# Altium schematic sheet uC.SchDoc
size A3; SheetNumber: 2; SheetTotal: 7
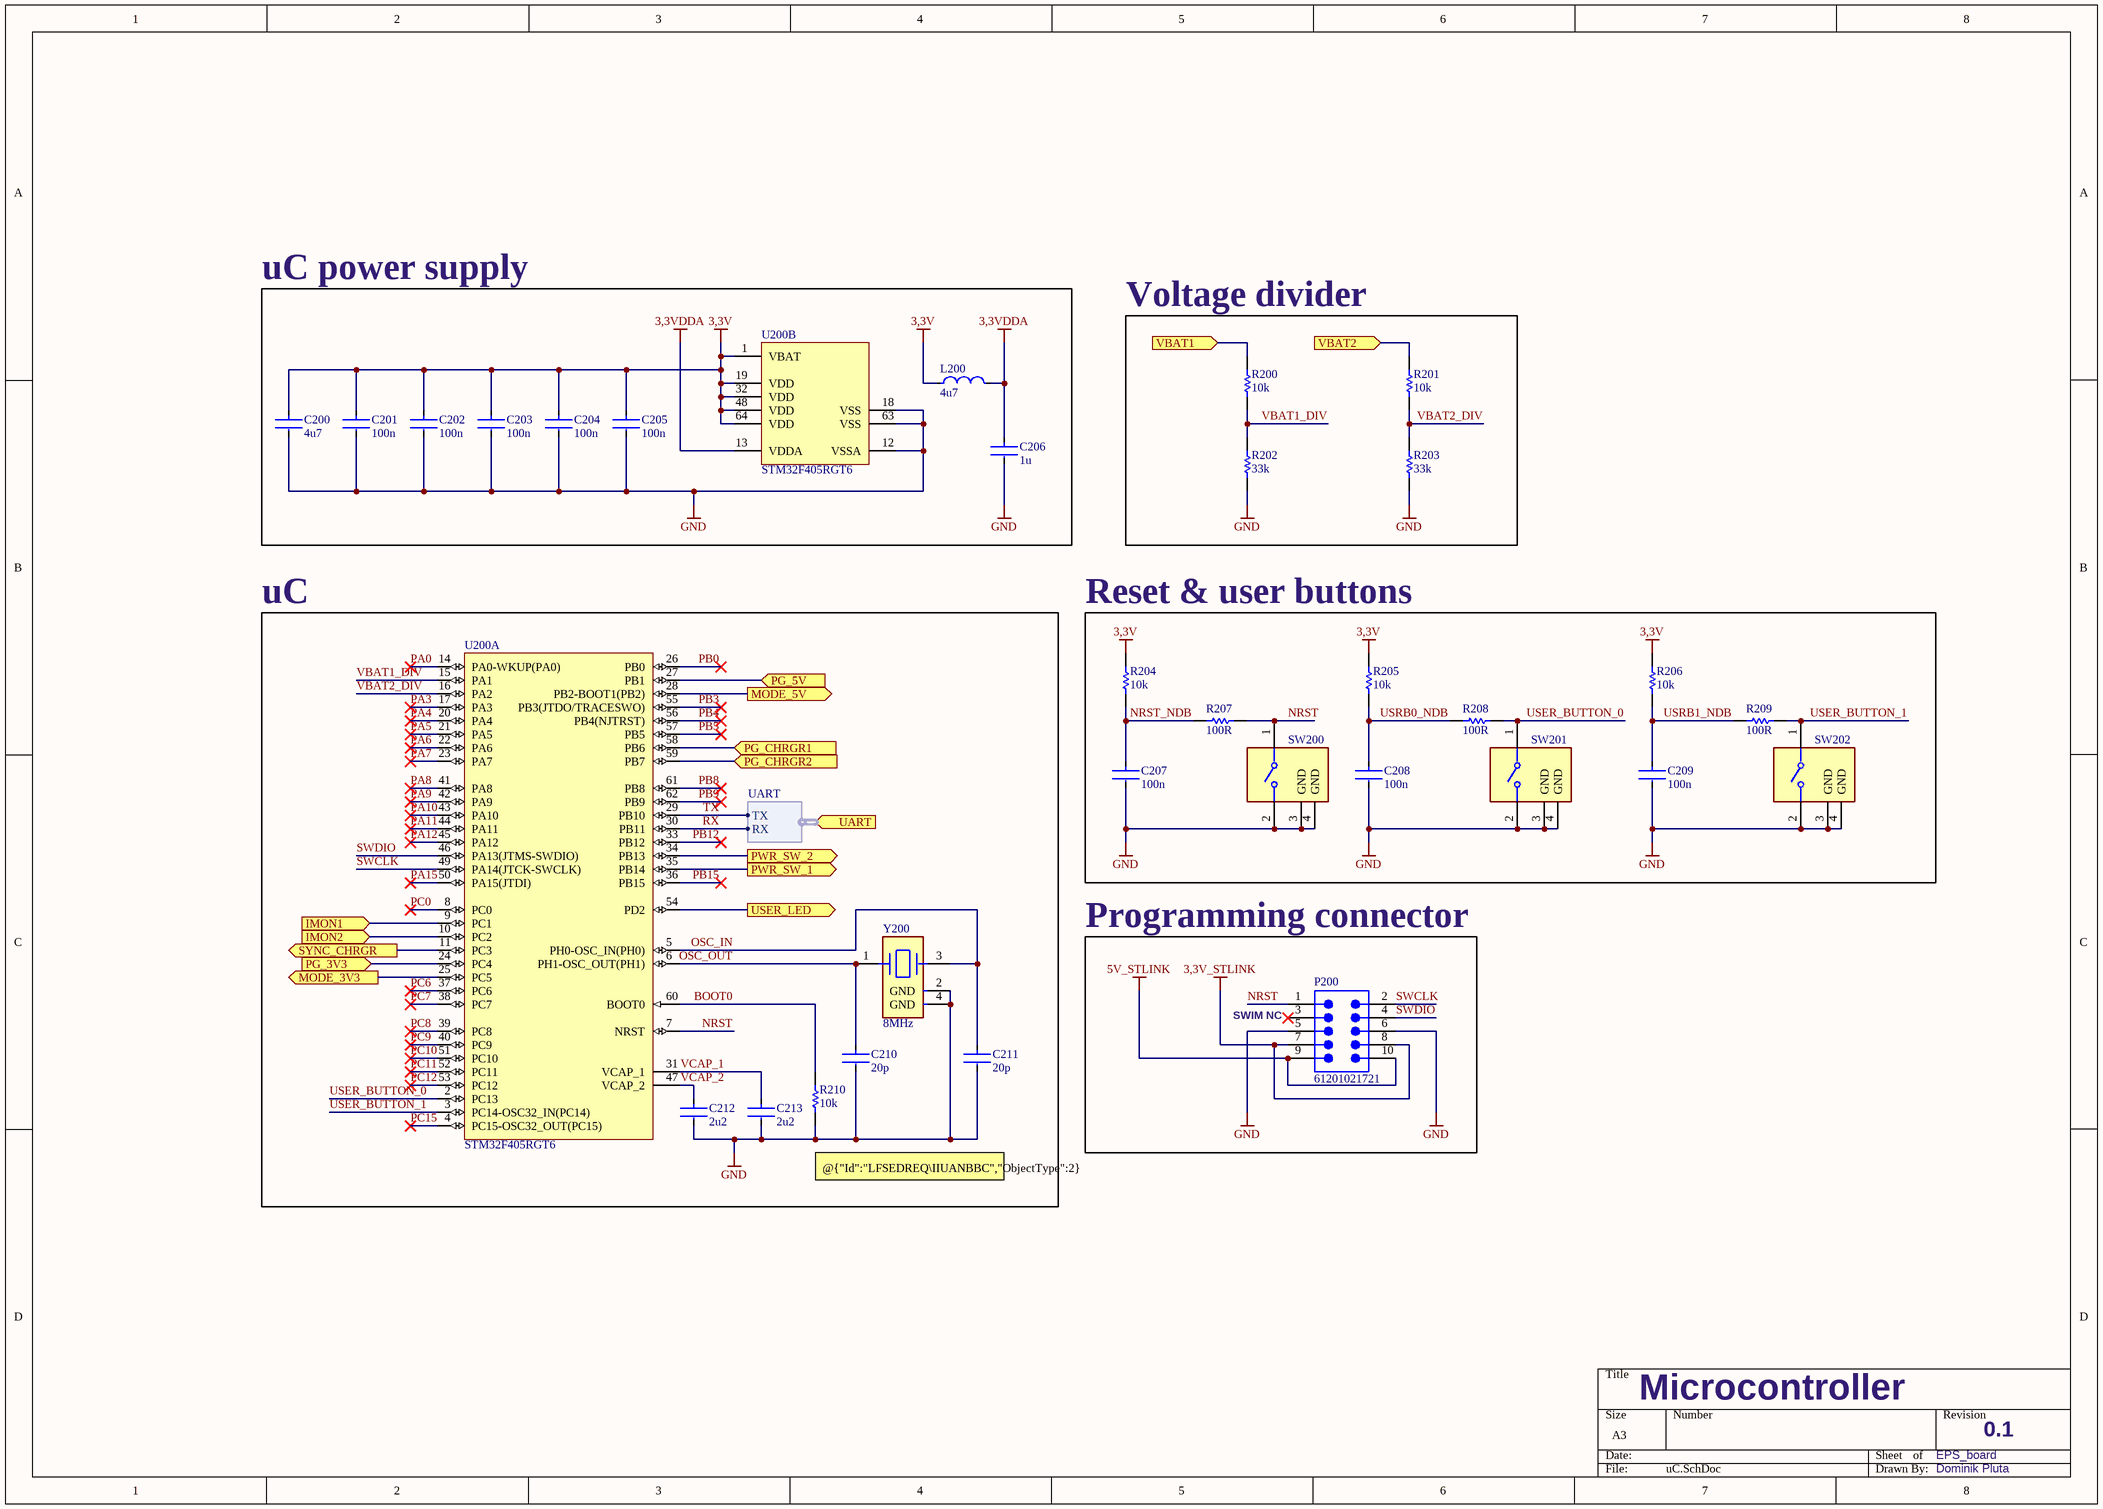
[diagram p0: uC.SchDoc]

## Parts
C200  4u7  [FP-C0603C-CF-MFG]
C201  100n  [FP-C0603C-CF-MFG]
C202  100n  [FP-C0603C-CF-MFG]
C203  100n  [FP-C0603C-CF-MFG]
C204  100n  [FP-C0603C-CF-MFG]
C205  100n  [FP-C0603C-CF-MFG]
C206  1u  [FP-C0603C-CF-MFG]
C207  100n  [FP-C0603C-CF-MFG]
C208  100n  [FP-C0603C-CF-MFG]
C209  100n  [FP-C0603C-CF-MFG]
C210  20p  [FP-C0603C-CF-MFG]
C211  20p  [FP-C0603C-CF-MFG]
C212  2u2  [FP-C0603C-CF-MFG]
C213  2u2  [FP-C0603C-CF-MFG]
L200  4u7  [FP-LQM21DN_00-MFG]
P200  61201021721  [61201021721]
R200  10k  [RESC0603(1608)_N]
R201  10k  [RESC0603(1608)_N]
R202  33k  [RESC0603(1608)_N]
R203  33k  [RESC0603(1608)_N]
R204  10k  [RESC0603(1608)_N]
R205  10k  [RESC0603(1608)_N]
R206  10k  [RESC0603(1608)_N]
R207  100R  [RESC0603(1608)_N]
R208  100R  [RESC0603(1608)_N]
R209  100R  [RESC0603(1608)_N]
R210  10k  [RESC0603(1608)_N]
SW200  B3F-3122  [FP-B3F-3122-MFG]  (value not drawn)
SW201  B3F-3122  [FP-B3F-3122-MFG]  (value not drawn)
SW202  B3F-3122  [FP-B3F-3122-MFG]  (value not drawn)
U200  STM32F405RGT6  [STM-LQFP64_M]  (parts A,B of 2)
Y200  8MHz  [FP-7M-MFG]

## Blocks framed on the sheet
uC power supply: C200-C206 L200 U200
Voltage divider: R200-R203
uC: C210-C213 R210 U200 Y200
Reset & user buttons: C207-C209 R204-R209 SW200-SW202
Programming connector: P200

## Ports
IMON1 (in, see EPS[2C]), IMON2 (in, see EPS[2C]), MODE_3V3 (out, see EPS[3C]), MODE_5V (out, see EPS[3C]), PG_3V3 (in, see EPS[3C]), PG_5V (in, see EPS[3C]), PG_CHRGR1 (in, see EPS[2C]), PG_CHRGR2 (in, see EPS[2C]), PWR_SW_1 (out, see EPS[3C], peripherals[2B]), PWR_SW_2 (out, see EPS[3C], peripherals[2C]), SYNC_CHRGR (out, see EPS[2C]), UART (in, harness UART, see EPS[3C], main_connector[1C]), USER_LED (out, see EPS[3C], peripherals[1B]), VBAT1 (in, see EPS[2C]), VBAT2 (in, see EPS[2C])

## Harnesses
UART: RX, TX

## Nets
3,3V: C200.1 C201.1 C202.1 C203.1 C204.1 C205.1 L200.1 R204.2 R205.2 R206.2 U200.1(VBAT) U200.19(VDD) U200.32(VDD) U200.48(VDD) U200.64(VDD)
3,3V_STLINK: P200.7 P200.8
3,3VDDA: C206.1 L200.2 U200.13(VDDA)
5V_STLINK: P200.9 P200.10
GND: C200.2 C201.2 C202.2 C203.2 C204.2 C205.2 C206.2 C207.2 C208.2 C209.2 C210.2 C211.2 C212.2 C213.2 P200.5 P200.6 R202.1 R203.1 R210.1 SW200.2 SW200.3(GND) SW200.4(GND) SW201.2 SW201.3(GND) SW201.4(GND) SW202.2 SW202.3(GND) SW202.4(GND) U200.12(VSSA) U200.18(VSS) U200.63(VSS) Y200.2(GND) Y200.4(GND)
BOOT0: R210.2 U200.60(BOOT0)
IMON1: U200.9(PC1) ; port IMON1
IMON2: U200.10(PC2) ; port IMON2
MODE_3V3: U200.25(PC5) ; port MODE_3V3
MODE_5V: U200.28(PB2-BOOT1(PB2)) ; port MODE_5V
NRST: P200.1 R207.1 SW200.1 U200.7(NRST)
NRST_NDB: C207.1 R204.1 R207.2
OSC_IN: C211.1 U200.5(PH0-OSC_IN(PH0)) Y200.3
OSC_OUT: C210.1 U200.6(PH1-OSC_OUT(PH1)) Y200.1
PA0: U200.14(PA0-WKUP(PA0))
PA3: U200.17(PA3)
PA4: U200.20(PA4)
PA5: U200.21(PA5)
PA6: U200.22(PA6)
PA7: U200.23(PA7)
PA8: U200.41(PA8)
PA9: U200.42(PA9)
PA10: U200.43(PA10)
PA11: U200.44(PA11)
PA12: U200.45(PA12)
PA15: U200.50(PA15(JTDI))
PB0: U200.26(PB0)
PB3: U200.55(PB3(JTDO/TRACESWO))
PB4: U200.56(PB4(NJTRST))
PB5: U200.57(PB5)
PB8: U200.61(PB8)
PB9: U200.62(PB9)
PB12: U200.33(PB12)
PB15: U200.36(PB15)
PC0: U200.8(PC0)
PC6: U200.37(PC6)
PC7: U200.38(PC7)
PC8: U200.39(PC8)
PC9: U200.40(PC9)
PC10: U200.51(PC10)
PC11: U200.52(PC11)
PC12: U200.53(PC12)
PC15: U200.4(PC15-OSC32_OUT(PC15))
PG_3V3: U200.24(PC4) ; port PG_3V3
PG_5V: U200.27(PB1) ; port PG_5V
PG_CHRGR1: U200.58(PB6) ; port PG_CHRGR1
PG_CHRGR2: U200.59(PB7) ; port PG_CHRGR2
PWR_SW_1: U200.35(PB14) ; port PWR_SW_1
PWR_SW_2: U200.34(PB13) ; port PWR_SW_2
RX: U200.30(PB11) ; port UART.RX
SWCLK: P200.2 U200.49(PA14(JTCK-SWCLK))
SWDIO: P200.4 U200.46(PA13(JTMS-SWDIO))
SYNC_CHRGR: U200.11(PC3) ; port SYNC_CHRGR
TX: U200.29(PB10) ; port UART.TX
USER_BUTTON_0: R208.1 SW201.1 U200.2(PC13)
USER_BUTTON_1: R209.1 SW202.1 U200.3(PC14-OSC32_IN(PC14))
USER_LED: U200.54(PD2) ; port USER_LED
USRB0_NDB: C208.1 R205.1 R208.2
USRB1_NDB: C209.1 R206.1 R209.2
VBAT1: R200.2 ; port VBAT1
VBAT1_DIV: R200.1 R202.2 U200.15(PA1)
VBAT2: R201.2 ; port VBAT2
VBAT2_DIV: R201.1 R203.2 U200.16(PA2)
VCAP_1: C213.1 U200.31(VCAP_1)
VCAP_2: C212.1 U200.47(VCAP_2)

Not connected (* = marked no-connect by the designer): P200 3*

## Notes on the sheet
- (near P200) SWIM NC
- @{"Id":"LFSEDREQ\IIUANBBC","ObjectType":2} = @{"Id":"LFSEDREQ\BUITQFAR","ObjectType":2} = (CL - 4pF) * 2
- Microcontroller
- EPS_board
- 0.1
- Dominik Pluta

## Library data of the parts
C200 C206 = CMP-2006-03061-2: CAP CER 0.1UF 50V X7R 0603; Manufacturer: KEMET; Manufacturer Part Number: C0603C104K5RACTU; Tolerance: 0.1; Temperature Coefficient: 30ppm/°C; Material: Ceramic; Automotive Grade: Grade 1; Value: 0.10 μF; Temperature: -55°C to +125°C; RoHS: TRUE; Temperature Range High: +125°C; Lead Free: Yes; Octopart: https://octopart.com/c0603c104k5ractu-kemet-139244; Digikey Description: CAP CER 0.1UF 50V X7R 0603; Category: Cap; Package: C0603C-CF; ComponentLink2Description: Datasheet; Temperature Range Low: -55°C; Device Class L1: Passive Components; Voltage Rating: 50 V; Automotive: Yes; Device Class L3: Ceramic Capacitors; ComponentLink2URL: https://api.kemet.com/component-edge/download/datasheet/C0603C100J5GACAUTO.pdf; Capacitance: 0.10 μF; Device Class L2: Capacitors; Temperature Characteristic: X7R; Height: 0.87mm
C201-C205 = CMP-2006-03061-2: CAP 0.1 μF, X5R or X7R ceramic; Tolerance: 10; Capacitance: 0.10 μF; Material: Ceramic; Category: Cap; Package: 0603; ComponentLink2Description: Datasheet; Device Class L1: Passive Components; Device Class L3: Ceramic Capacitors; ComponentLink2URL: https://api.kemet.com/component-edge/download/datasheet/C0603C100J5GACAUTO.pdf; Device Class L2: Capacitors
C207-C209 = CMP-2006-03061-2: CAP 0.1 μF, ceramic; Tolerance: 10; Capacitance: 0.10 μF; Material: Ceramic; Category: Cap; Package: 0603; ComponentLink2Description: Datasheet; Device Class L1: Passive Components; Device Class L3: Ceramic Capacitors; ComponentLink2URL: https://api.kemet.com/component-edge/download/datasheet/C0603C100J5GACAUTO.pdf; Device Class L2: Capacitors
C210-C213 = CMP-2006-03061-2: CAP CER 50V X7R 0603; Manufacturer: KEMET; Manufacturer Part Number: C0603C104K5RACTU; Tolerance: 0.1; Temperature Coefficient: 30ppm/°C; Material: Ceramic; Automotive Grade: Grade 1; Value: 0.10 μF; Temperature: -55°C to +125°C; RoHS: TRUE; Temperature Range High: +125°C; Lead Free: Yes; Octopart: https://octopart.com/c0603c104k5ractu-kemet-139244; Digikey Description: CAP CER 0.1UF 50V X7R 0603; Category: Cap; Package: C0603C-CF; ComponentLink2Description: Datasheet; Temperature Range Low: -55°C; Device Class L1: Passive Components; Voltage Rating: 50 V; Automotive: Yes; Device Class L3: Ceramic Capacitors; ComponentLink2URL: https://api.kemet.com/component-edge/download/datasheet/C0603C100J5GACAUTO.pdf; Capacitance: 0.10 μF; Device Class L2: Capacitors; Temperature Characteristic: X7R; Height: 0.87mm
L200 = CMP-06042-016438-1: Multilayer Type Inductor for General Circuits, 0805 (2012), 0.22μH, 10%, 0.38Ω, 250mA; Shielding: Shielded; Self Resonant Frequency: 220MHz; Q Factor: 20; DC Resistance (DCR): 380mR; Inductance: 220nH; Core Material: Ferrite; Test Frequency: 25MHz; Min Operating Temperature: -40°C; RoHS Compliant: Yes; Inductance Tolerance: 10%; Width: 1.25mm; Current Rating: 250mA; Rated Current-Max: 250mA; Package Quantity: 4000; Lead Free: Lead Free; Termination: SMD/SMT; Military Standard: Not; Case Code (Metric): 2012; Radiation Hardening: No; Max Operating Temperature: 85°C; Max DC Current: 250mA; Mount: Surface Mount; Length: 2mm; Packaging: Tape and Reel; Height - Seated (Max): 0.041inch; Series: LQM21N; Case Code (Imperial): 0805; Case/Package: 0805; REACH SVHC: No SVHC; Depth: 1.45mm; Tolerance: 10%; DC Current: 250mA; Number of Pins: 2; Height: 0.85mm
P200 = CMP-1502-00021-2: NexarPartId: 8917787; Operating Supply Voltage: 250V; Number of Positions: 10; Contact Resistance: 20mΩ; Connector Type: Male Pin; Current Rating: 3A; Pitch: 2.54mm; Gender: Male; Insulation Resistance: 1GΩ; Insulation: Insulated; Max Operating Temperature: 105°C; Flammability Rating: UL94 V-0; Mount: Through Hole; Contact Material: Copper; Min Operating Temperature: -40°C; Length: 20.36mm; Number of Contacts: 10; Height: 8.85mm; Number of Rows: 2; Housing Material: PBT; Color: Black; Contact Gender: Male; Orientation: Right Angle; Contact Plating: Gold; Number of Pins: 10; Voltage Rating (DC): 250V; RoHS: Compliant; Insulation Material: PBT; REACH SVHC: Unknown; Row Spacing: 2.54mm; Voltage Rating: 250V; Width: 20.36mm; Lead Pitch: 2.54mm; Termination: Through Hole
R200 R204-R206 R210 = CMP-1012-00081-1: 10k 0.1W 5% 0603 SMD; Case-Metric: 1608; Value: 10000.00 Ohm; Case-EIA: 0603; Tolerance: 5 %; Technology: SMT; Power: 0.1 W
R201 = CMP-1012-00081-1: 10k 0.1W 5% 0603  SMD; Case-Metric: 1608; Value: 10000.00 Ohm; Case-EIA: 0603; Tolerance: 5 %; Technology: SMT; Power: 0.1 W
R202 R203 = CMP-1012-00081-1: 33k 0.1W 5% 0603 SMD; Case-Metric: 1608; Value: 33000.00 Ohm; Case-EIA: 0603; Tolerance: 5 %; Technology: SMT; Power: 0.1 W
R207-R209 = CMP-1012-00081-1: 100R 0.1W 5% 0603  SMD; Case-Metric: 1608; Value: 100.00 Ohm; Case-EIA: 0603; Tolerance: 5 %; Technology: SMT; Power: 0.1 W
SW200-SW202 = CMP-08834-000053-1: SWITCH TACTILE SPST-NO 0.05A 24V; Max Current Rating: 50mA; Actuator Type: Standard; Ratings: IP00; Number of Poles: 1; Mechanical Life: 300000Cycles; Illumination Type: Non-Illuminated; Switch Function: Off-Mom; Actuator Color: Grey; Contact Resistance: 100mR; Throw Configuration: SPST; Actuator Length: 1.6mm; Switch Travel: 0.25mm; Operating Force: 1.47N; Weight: 0.25g; Voltage Rating (DC): 24V; Contact Plating: Gold; RoHS Compliant: Yes; Contact Material: Gold; Radiation Hardening: No; Packaging: Bulk; Height: 7.4mm; Min Operating Temperature: -25°C; Electrical Life: 300000Cycles; Depth: 7.85mm; Max Voltage Rating (DC): 24V; Mount: Through Hole; Width: 6.25mm; Current Rating: 50mA; Lead Free: Lead Free; Max Operating Temperature: 70°C; Series: B3F; Contact Current Rating: 50mA; Package Quantity: 1000; Termination: PC Pins; Orientation: Right Angle; Length: 7.3mm
U200 = CMP-0243-00019-3: ARM Cortex-M4 32-bit MCU+FPU, 210 DMIPS, 1024 kB Flash, 192 kB Internal RAM, 51 I/Os, 64-pin LQFP, -40 to 85 degC, Tray; Manufacturer: STMicroelectronics; Supply Voltage(Vcc) min (V): 1.8; Supply Voltage(Vcc) max (V): 3.6; Internal RAM Size (kB): 192; I/Os (High Current): 51; D/A Converter: 2x12-bit; FLASH Size (Prog) (kB): 1024; Operating Frequency(F) (Processor speed) (MHz): 168; ComponentLink2Description: Datasheet; PackageVersion: Rev. 4, 06/2013; DatasheetVersion: Rev. 4; Core: ARM Cortex-M4; ComponentLink2URL: http://www.st.com/st-web-ui/static/active/en/resource/technical/document/datasheet/DM00037051.pdf; PackageReference: LQFP64; Packing: Tray; ComponentLink1Description: Manufacturer URL; ComponentLink3URL: http://www.st.com/st-web-ui/static/active/en/resource/technical/document/datasheet/DM00037051.pdf; ComponentLink3Description: Package Specification; Mounting Technology: Surface Mount; ComponentLink1URL: http://www.st.com/web/en/home.html; PackageDescription: 64-Pin Low Profile Quad Flat Package, 10 x 10 mm Body, 0.5 mm Pitch; PartNumber: STM32F405RGT6
Y200 = CMP-18717-000311-1: Crystal oscillator 8MHz; ESR (Equivalent Series Resistance): 100R; Frequency Stability: 10ppm; Load Capacitance: 10pF; Width: 0.098inch; Number of Pins: 4; Case/Package: SMD/SMT; REACH SVHC: No SVHC; Frequency: 8MHz; Mount: Surface Mount; Max Operating Temperature: 70°C; RoHS Compliant: Yes; Depth: 2.5mm; Length: 3.2mm; Termination: SMD/SMT; Frequency Tolerance: 10ppm; Min Operating Temperature: -20°C; Series: 7M; Packaging: Tape and Reel; Tolerance: 10ppm; Height: 0.031inch; Package Quantity: 3000